# EAGLE schematic oven_thermocouple_circuit_v2 (EAGLE 6.4)
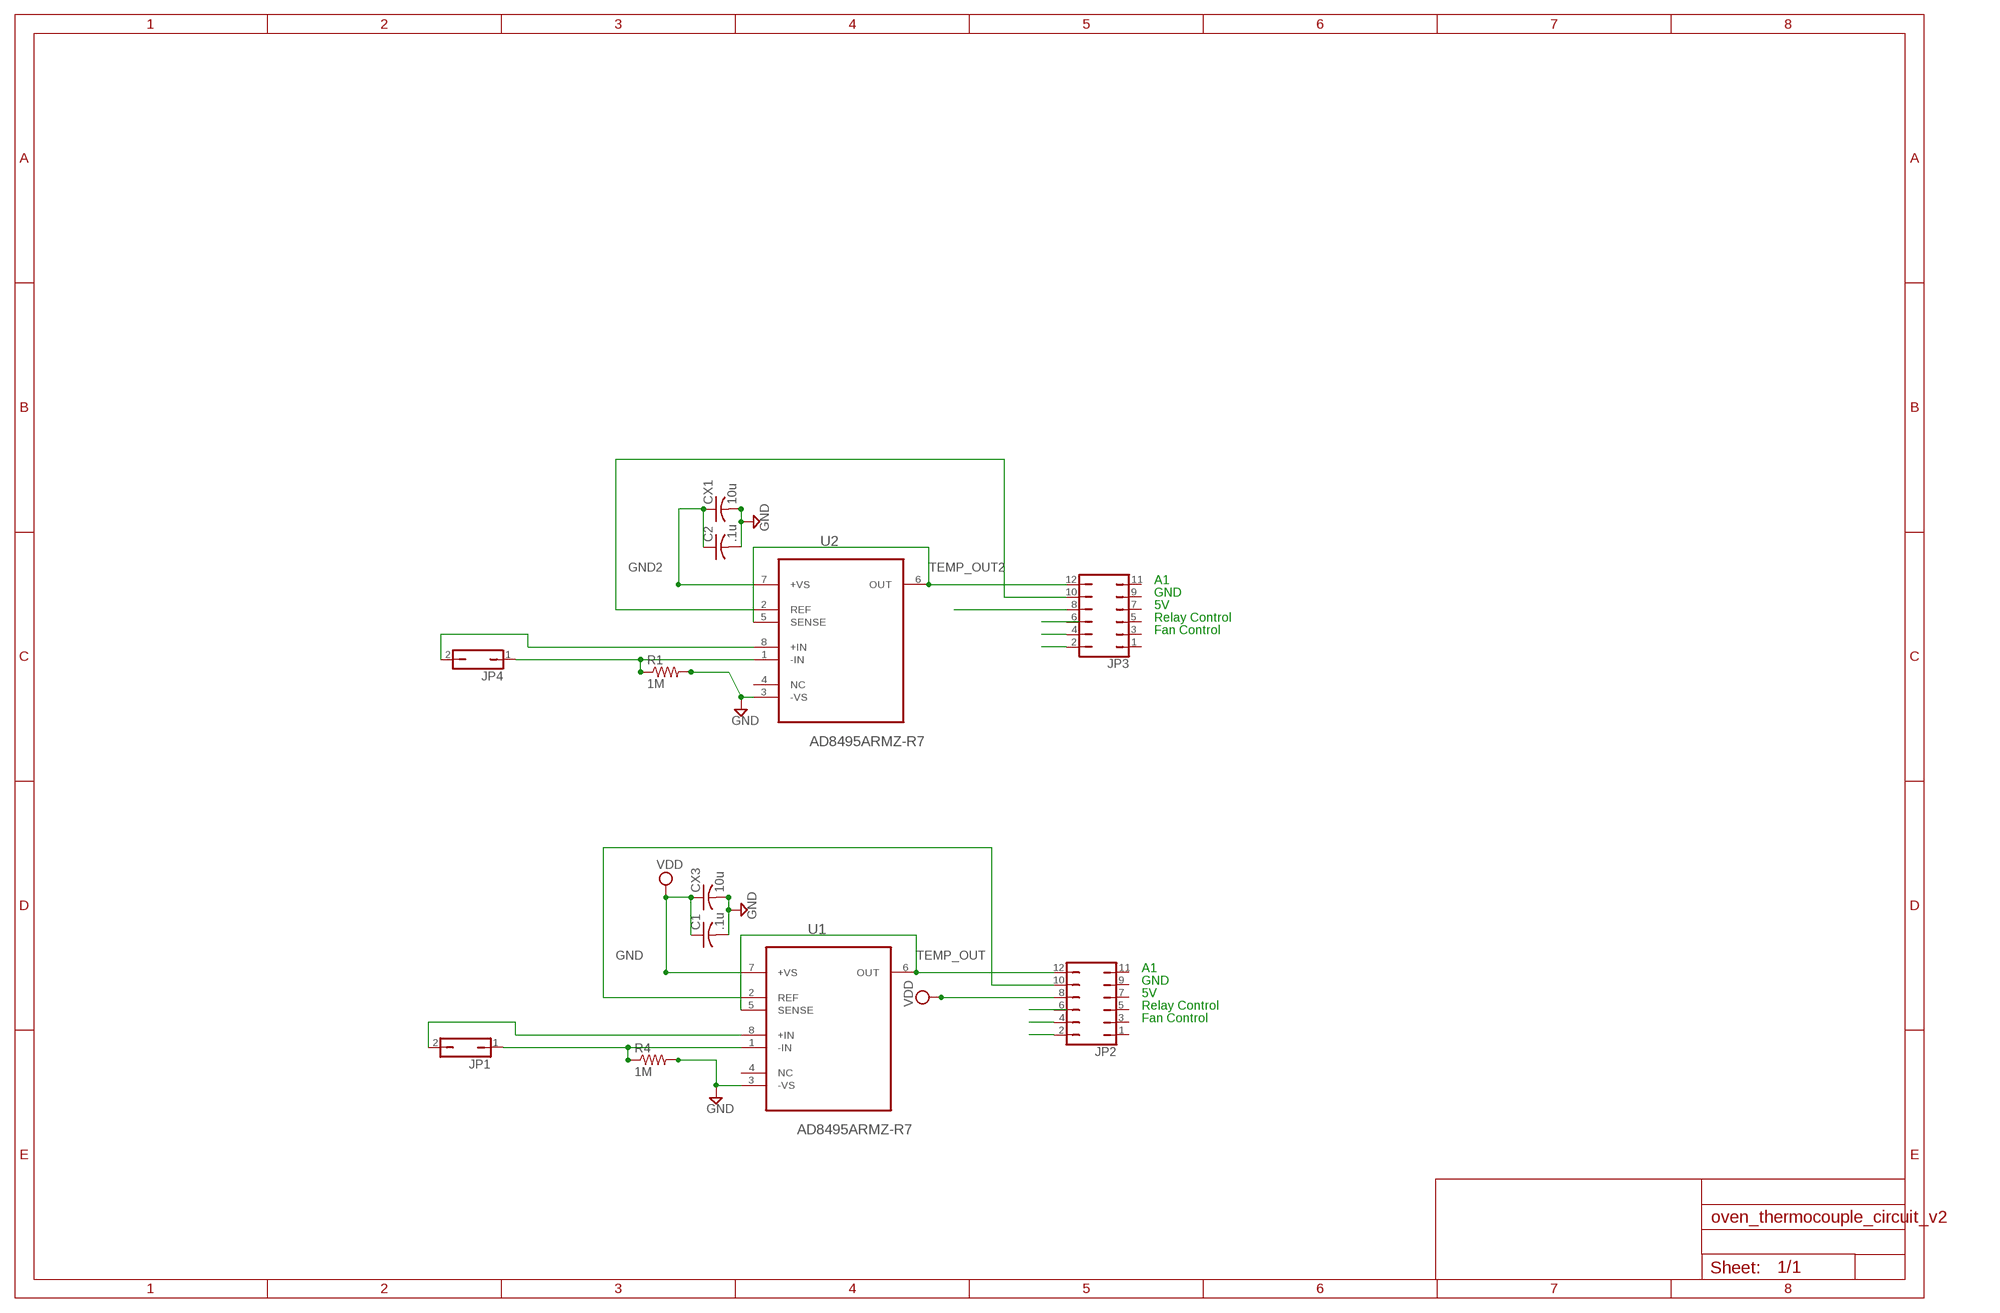
[diagram p0: schematic, sheet 1]

## Parts
C1  .1u  C-US  [C0805]
C2  .1u  C-US  [C0805]
CX1  10u  C-USC0805  [C0805]
CX3  10u  C-USC0805  [C0805]
JP1  JP1Q  [JP1]
JP2  JP6Q  [JP6Q]
JP3  JP6Q  [JP6Q]
JP4  JP1Q  [JP1]
R1  1M  R-US_R0805W  [R0805W]
R4  1M  R-US_R0805W  [R0805W]
U1  AD8495ARMZ-R7  [SOP65P490X110-8N]
U2  AD8495ARMZ-R7  [SOP65P490X110-8N]

## Nets
EXTRA: JP2.2
EXTRA1: JP3.2
FANCONTROL: JP2.4
FANCONTROL1: JP3.4
GND: C1.2 CX3.2 JP2.10 R4.2 U1.2(REF) U1.3(-VS)
GND2: C2.2 CX1.2 JP3.10 R1.2 U2.2(REF) U2.3(-VS) ; supply symbol labelled GND
IN+: JP4.2 U2.8(+IN)
IN-: JP4.1 R1.1 U2.1(-IN)
N$10: JP1.2 U1.8(+IN)
N$11: JP1.1 R4.1 U1.1(-IN)
RELAYCONTROL: JP2.6
RELAYCONTROL1: JP3.6
TEMP_OUT: JP2.12 U1.5(SENSE) U1.6(OUT)
TEMP_OUT2: JP3.12 U2.5(SENSE) U2.6(OUT)
VDD: C1.1 CX3.1 JP2.8 U1.7(+VS)
VDD2: C2.1 CX1.1 JP3.8 U2.7(+VS)
Unconnected: JP2.1 JP2.3 JP2.5 JP2.7 JP2.9 JP2.11 JP3.1 JP3.3 JP3.5 JP3.7 JP3.9 JP3.11 U1.4(NC) U2.4(NC)

## Notes on the sheet
- A1
- GND
- 5V
- Relay Control
- Fan Control
- A1
- GND
- 5V
- Relay Control
- Fan Control

## Library data of the parts
C1 C2 CX1 CX3 = resistor:C-US: CAPACITOR, American symbol
JP1 JP4 = jumper:JP1Q: JUMPER
JP2 JP3 = jumper:JP6Q: JUMPER
R1 R4 = rcl:R-US_: RESISTOR, American symbol
U1 U2 = Analog Devices_By_element14_Batch_1:AD8495ARMZ-R7: Precision Thermocouple Amplifiers with Cold Junction Compensation; MPN: AD8495ARMZ-R7; OC_FARNELL: -; OC_NEWARK: 85R6447; PACKAGE: MSOP-8; SUPPLIER: Analog Devices

## Net classes
0 default: width 0.203 mm, drill 0.508 mm, clearance 0.254 mm